# EAGLE design rekick004 (EAGLE 4.16)

## Sheet 1 of 2
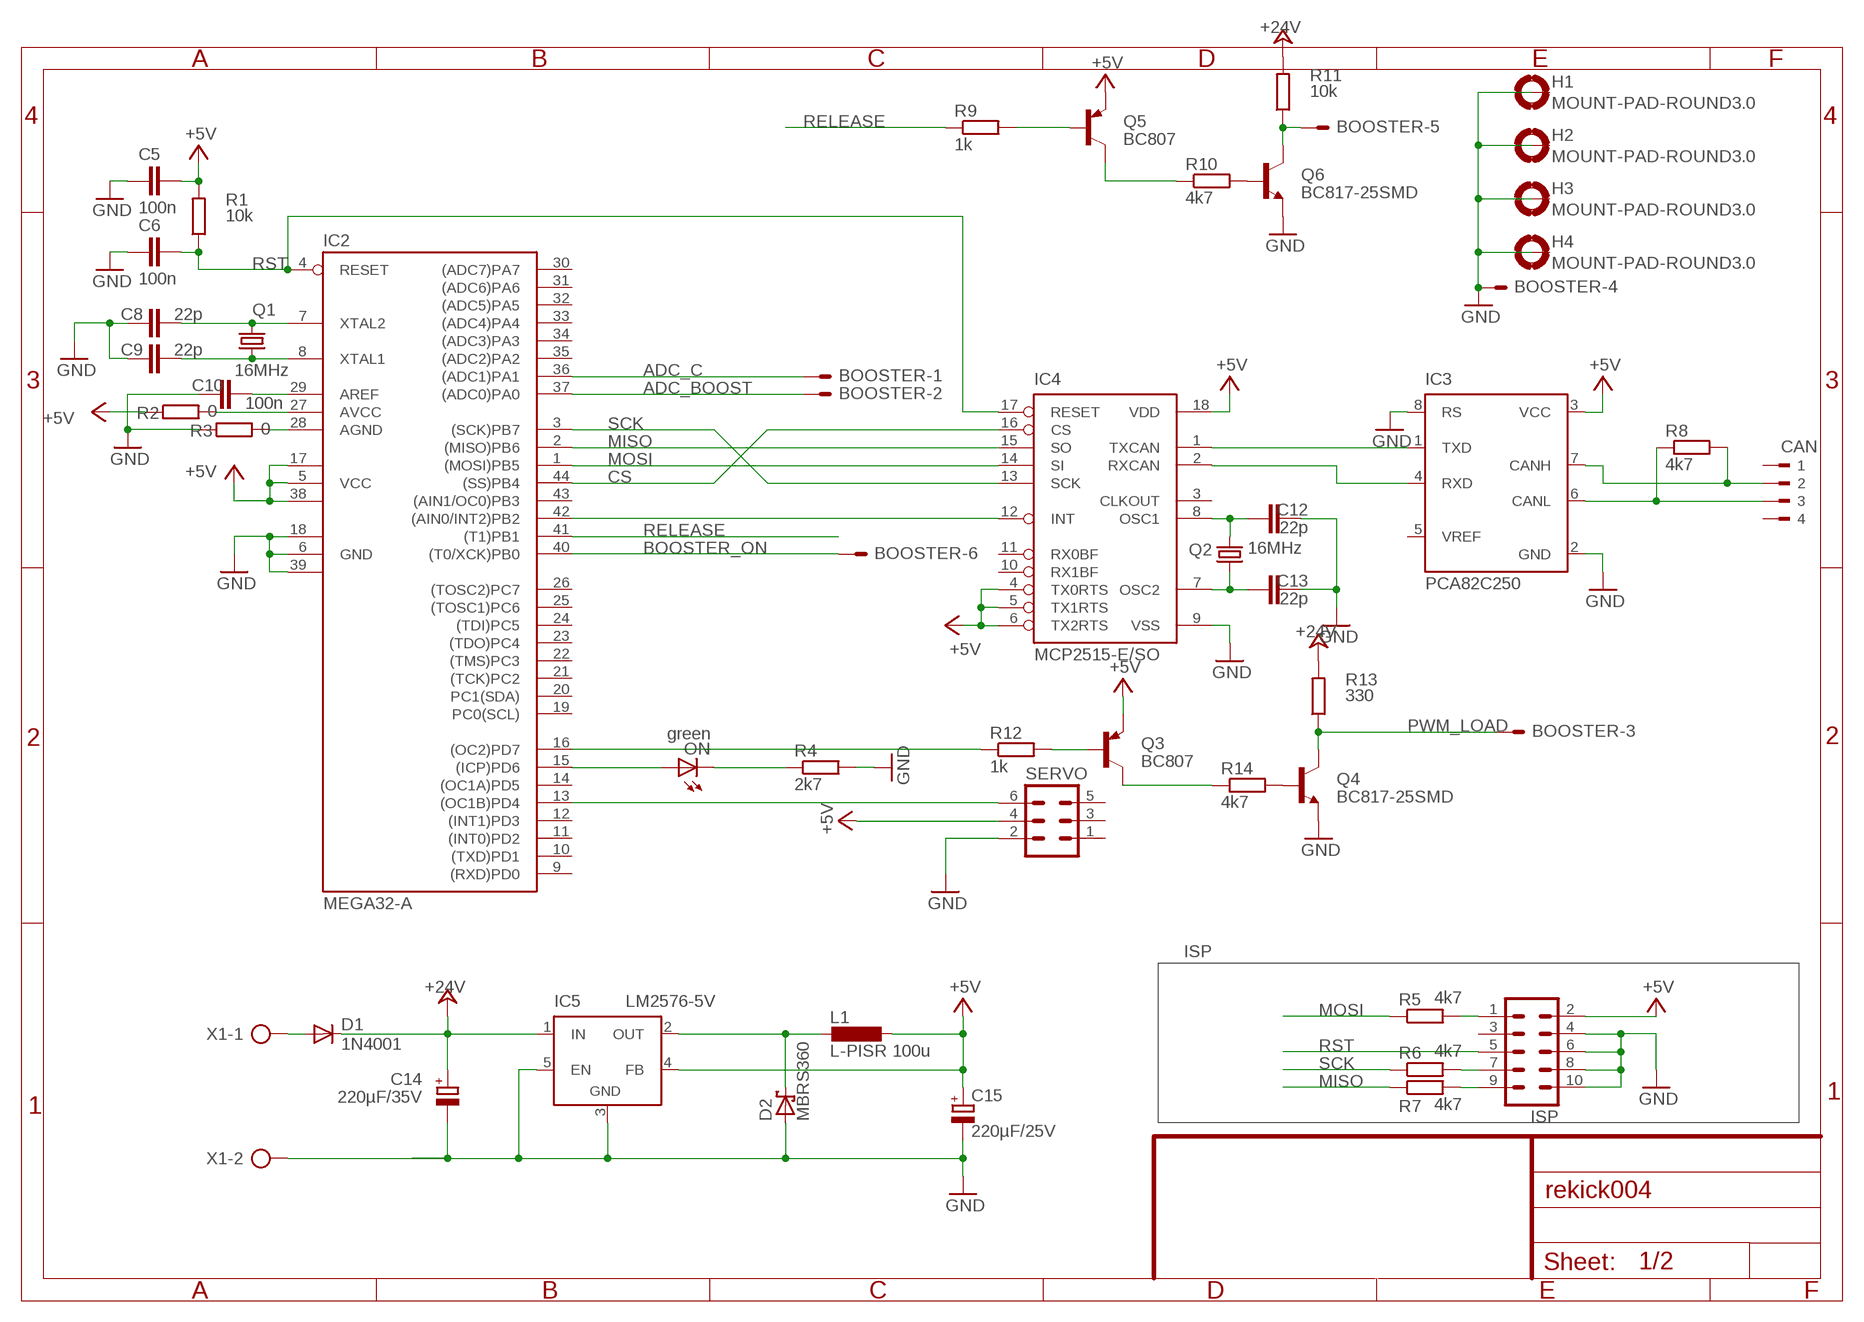
[diagram p0: schematic, sheet 1]

### Parts
BOOSTER  ML6LE  [ML6L]
C5  100n  C-EUC0603  [C0603]
C6  100n  C-EUC0603  [C0603]
C8  22p  C-EUC0603  [C0603]
C9  22p  C-EUC0603  [C0603]
C10  100n  C-EUC0603  [C0603]
C12  22p  C-EUC0603  [C0603]
C13  22p  C-EUC0603  [C0603]
C14  220µF/35V  CPOL-EUE5-10.5  [E5-10,5]
C15  220µF/25V  CPOL-EUE3.5-10  [E3,5-10]
CAN  90-4  [90-4]
D1  1N4001  1N4004  [DO41-10]
D2  MBRS360  SCHOTTKY-DIODESMD  [SMB]
H1  MOUNT-PAD-ROUND3.0  [3,0-PAD]
H2  MOUNT-PAD-ROUND3.0  [3,0-PAD]
H3  MOUNT-PAD-ROUND3.0  [3,0-PAD]
H4  MOUNT-PAD-ROUND3.0  [3,0-PAD]
IC2  MEGA32-A  [TQFP44]
IC3  PCA82C250  [DIL08]
IC4  MCP2515-E/SO  [SO18L]
IC5  LM2576-5V  LM2596TV  [TO220-51]
ISP  MA05-2  [MA05-2]
L1  L-PISR 100u  L-EUWE-TPC  [POWER-CHOKE_WE-TPC]
ON  green  LED3MM  [LED3MM]
Q1  16MHz  CRYSTALHC49S  [HC49/S]
Q2  16MHz  CRYSTALHC49U-V  [HC49U-V]
Q3  BC807  BC807-40SMD  [SOT23-BEC]
Q4  BC817-25SMD  [SOT23-BEC]
Q5  BC807  BC807-40SMD  [SOT23-BEC]
Q6  BC817-25SMD  [SOT23-BEC]
R1  10k  R-EU_R0805  [R0805]
R2  0  R-EU_R0805  [R0805]
R3  0  R-EU_R0805  [R0805]
R4  2k7  R-EU_R0805  [R0805]
R5  4k7  R-EU_R0805  [R0805]
R6  4k7  R-EU_R0805  [R0805]
R7  4k7  R-EU_R0805  [R0805]
R8  4k7  R-EU_R0805  [R0805]
R9  1k  R-EU_R0805  [R0805]
R10  4k7  R-EU_R0805  [R0805]
R11  10k  R-EU_R0805  [R0805]
R12  1k  R-EU_R0805  [R0805]
R13  330  R-EU_R0805  [R0805]
R14  4k7  R-EU_R0805  [R0805]
SERVO  ML6L  [ML6L]
X1  AK500/2-H  [AK500/2-H]

### Nets
+5V [Power]: C5.2 C15.+ IC2.5(VCC) IC2.17(VCC1) IC2.38(VCC2) IC3.3(VCC) IC4.4(TX0RTS) IC4.5(TX1RTS) IC4.6(TX2RTS) IC4.18(VDD) IC5.4(FB) ISP.2 L1.1 Q3.E Q5.E R1.2 R2.1 SERVO.4
+24V [Power]: C14.+ D1.C IC5.1(IN) R11.2 R13.2
ADC_BOOST: BOOSTER.2 IC2.37((ADC0)PA0)
ADC_C: BOOSTER.1 IC2.36((ADC1)PA1)
BOOSTER_ON: BOOSTER.6 IC2.40((T0/XCK)PB0)
CS: IC2.44((SS)PB4) IC4.16(CS)
GND [Power]: BOOSTER.4 C5.1 C6.1 C8.1 C9.2 C10.1 C12.2 C13.2 C14.- C15.- D2.A H1.B3,0(MOUNT) H2.B3,0(MOUNT) H3.B3,0(MOUNT) H4.B3,0(MOUNT) IC2.6(GND) IC2.18(GND1) IC2.39(GND2) IC3.2(GND) IC3.8(RS) IC4.9(VSS) IC5.3(GND) IC5.5(EN) ISP.4 ISP.6 ISP.8 ISP.10 Q4.E Q6.E R3.1 R4.2 SERVO.2 X1.2
MISO: IC2.2((MISO)PB6) IC4.15(SO) R7.1
MOSI: IC2.1((MOSI)PB5) IC4.14(SI) R5.1
N$1: IC2.15((ICP)PD6) ON.A
N$2: C10.2 IC2.29(AREF)
N$3: IC2.27(AVCC) R2.2
N$4: C9.1 IC2.8(XTAL1) Q1.1
N$5: C8.2 IC2.7(XTAL2) Q1.2
N$6: ISP.1 R5.2
N$7: IC2.28(AGND) R3.2
N$8: ISP.7 R6.2
N$9: ISP.9 R7.2
N$11: IC2.42((AIN0/INT2)PB2) IC4.12(INT)
N$12: IC3.1(TXD) IC4.1(TXCAN)
N$13: IC2.16((OC2)PD7) R12.1
N$14: IC2.13((OC1B)PD4) SERVO.6
N$21: Q3.C R14.1
N$22: IC3.4(RXD) IC4.2(RXCAN)
N$23: Q4.B R14.2
N$24: CAN.3 IC3.6(CANL) R8.1
N$25: Q3.B R12.2
N$26: D1.A X1.1
N$28: Q6.B R10.2
N$29: BOOSTER.5 Q6.C R11.1
N$30 [Power]: D2.C IC5.2(OUT) L1.2
N$31: ON.K(C) R4.1
N$32: Q5.C R10.1
N$33: Q5.B R9.2
N$53: C13.1 IC4.7(OSC2) Q2.1
N$54: C12.1 IC4.8(OSC1) Q2.2
N$59: CAN.2 IC3.7(CANH) R8.2
PWM_LOAD: BOOSTER.3 Q4.C R13.1
RELEASE: IC2.41((T1)PB1) R9.1
RST: C6.2 IC2.4(RESET) IC4.17(RESET) ISP.5 R1.1
SCK: IC2.3((SCK)PB7) IC4.13(SCK) R6.1
Unconnected: CAN.1 CAN.4 IC2.9((RXD)PD0) IC2.10((TXD)PD1) IC2.11((INT0)PD2) IC2.12((INT1)PD3) IC2.14((OC1A)PD5) IC2.19(PC0(SCL)) IC2.20(PC1(SDA)) IC2.21((TCK)PC2) IC2.22((TMS)PC3) IC2.23((TDO)PC4) IC2.24((TDI)PC5) IC2.25((TOSC1)PC6) IC2.26((TOSC2)PC7) IC2.30((ADC7)PA7) IC2.31((ADC6)PA6) IC2.32((ADC5)PA5) IC2.33((ADC4)PA4) IC2.34((ADC3)PA3) IC2.35((ADC2)PA2) IC2.43((AIN1/OC0)PB3) IC3.5(VREF) IC4.3(CLKOUT) IC4.10(RX1BF) IC4.11(RX0BF) ISP.3 SERVO.1 SERVO.3 SERVO.5

### Notes on the sheet
- ISP

## Sheet 2 of 2
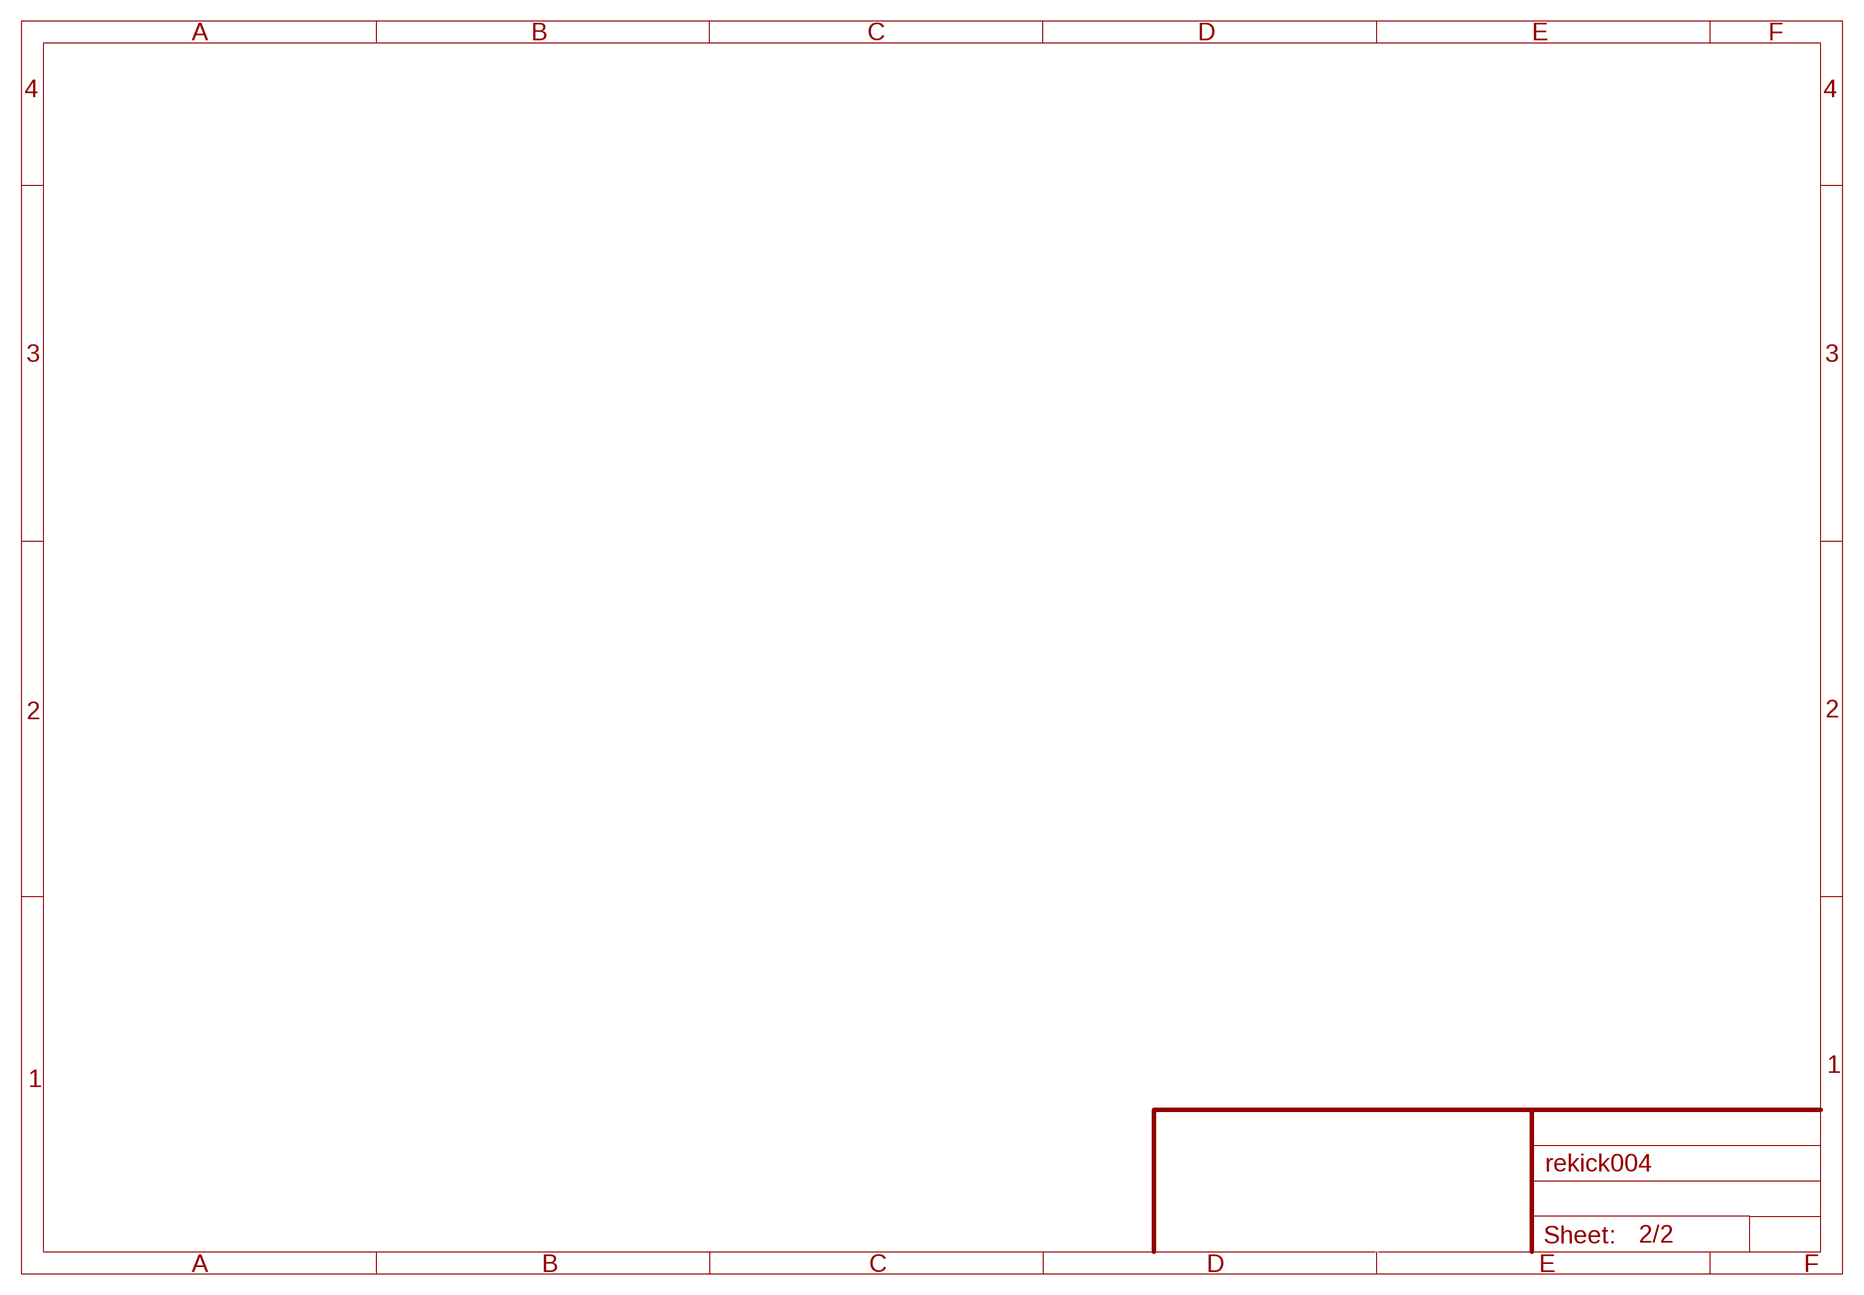
[diagram p1: schematic, sheet 2]

## Library data of the parts
BOOSTER = con-harting-ml:ML6?E: HARTING
C5 C6 C8-C10 C12 C13 = rcl:C-EU: CAPACITOR, European symbol
C14 C15 = rcl:CPOL-EU: POLARIZED CAPACITOR, European symbol
CAN = con-weidmueller-sl35:90-4: WEIDMUELLER CLAMP CONNECTOR
D1 = diode:1N4004: DIODE general purpose rectifier, 1 A
D2 = diode:SCHOTTKY-DIODE: Schottky Diode
H1-H4 = holes:MOUNT-PAD-ROUND: MOUNTING PAD, round
IC2 = atmel:MEGA32: MICROCONTROLLER 32 Kbytes FLASH 2 Kbytes SRAM 1 Kbytes EEPROM USART 8-channel 10 bit ADC Source: www.atmel.com .. doc2503.pdf
IC3 = micro-philips:PCA82C250: CAN CONTROLLER INTERFACE
IC4 = mcp2515:MCP2515
IC5 = linear:LM2596T: STEP-DOWN VOLTAGE REGULATOR
ISP = con-lstb:MA05-2: PIN HEADER
L1 = rcl:L-EU: INDUCTOR, European symbol
ON = led:LED: LED OSRAM: - CHIPLED LG R971, LG N971, LY N971, LG Q971, LY Q971, LO R971, LY R971 LH N974, LH R974 LS Q976, LO Q976, LY Q976 LO Q996 - Hyper CHIPLED LW Q18S LB Q993, LB Q99A, LB R99A - SideLED LS A670, LO A670, LY A670, LG A670, LP A670 LB A673, LV A673, LT A673, LW A673 LH A674 LY A675 LS A676, LA A676, LO A676, LY A676, LW A676 LS A679, LY A679, LG A679 - Hyper Micro SIDELED® LS Y876, LA Y876, LO Y876, LY Y876 LT Y87S - SmartLED LW L88C, LW L88S LB L89C, LB L89S, LG L890 LS L89K, LO L89K, LY L89K LS L896, LA L896, LO L896, LY L896 - TOPLED LS T670, LO T670, LY T670, LG T670, LP T670 LSG T670, LSP T670, LSY T670, LOP T670, LYG T670 LG T671, LOG T671, LSG T671 LB T673, LV T673, LT T673, LW T673 LH T674 LS T676, LA T676, LO T676, LY T676, LB T676, LH T676, LSB T676, LW T676 LB T67C, LV T67C, LT T67C, LS T67K, LO T67K, LY T67K, LW E67C LS E67B, LA E67B, LO E67B, LY E67B, LB E67C, LV E67C, LT E67C LW T67C LS T679, LY T679, LG T679 LS T770, LO T770, LY T770, LG T770, LP T770 LB T773, LV T773, LT T773, LW T773 LH T774 LS E675, LA E675, LY E675, LS T675 LS T776, LA T776, LO T776, LY T776, LB T776 LHGB T686 LT T68C, LB T68C - Hyper Mini TOPLED® LB M676 - Mini TOPLED Santana® LG M470 LS M47K, LO M47K, LY M47K Source: http://www.osram.convergy.de - LUMILED® LXK2-PW12-R00, LXK2-PW12-S00, LXK2-PW14-U00, LXK2-PW14-V00 LXK2-PM12-R00, LXK2-PM12-S00, LXK2-PM14-U00 LXK2-PE12-Q00, LXK2-PE12-R00, LXK2-PE12-S00, LXK2-PE14-T00, LXK2-PE14-U00 LXK2-PB12-K00, LXK2-PB12-L00, LXK2-PB12-M00, LXK2-PB14-N00, LXK2-PB14-P00, LXK2-PB14-Q00 LXK2-PR12-L00, LXK2-PR12-M00, LXK2-PR14-Q00, LXK2-PR14-R00 LXK2-PD12-Q00, LXK2-PD12-R00, LXK2-PD12-S00 LXK2-PH12-R00, LXK2-PH12-S00 LXK2-PL12-P00, LXK2-PL12-Q00, LXK2-PL12-R00 Source: www.luxeon.com
Q1 Q2 = crystal:CRYSTAL: CRYSTAL
Q3 Q5 = transistor-pnp:BC807*: PNP Transistror
Q4 Q6 = transistor-npn:BC817*: NPN Transistor
R1-R14 = rcl:R-EU_: RESISTOR, European symbol
SERVO = con-harting-ml:ML6: HARTING
X1 = con-ptr500:AK500/2-H: CONNECTOR Aug. 2004 / PTR Meßtechnik: Die Bezeichnung der Serie AK505 wurde geändert. Es handelt sich hierbei um AK500 in horizontaler Ausführung.

## Net classes
1 Power: width 0.406 mm
2 High Power: width 2 mm

## Board
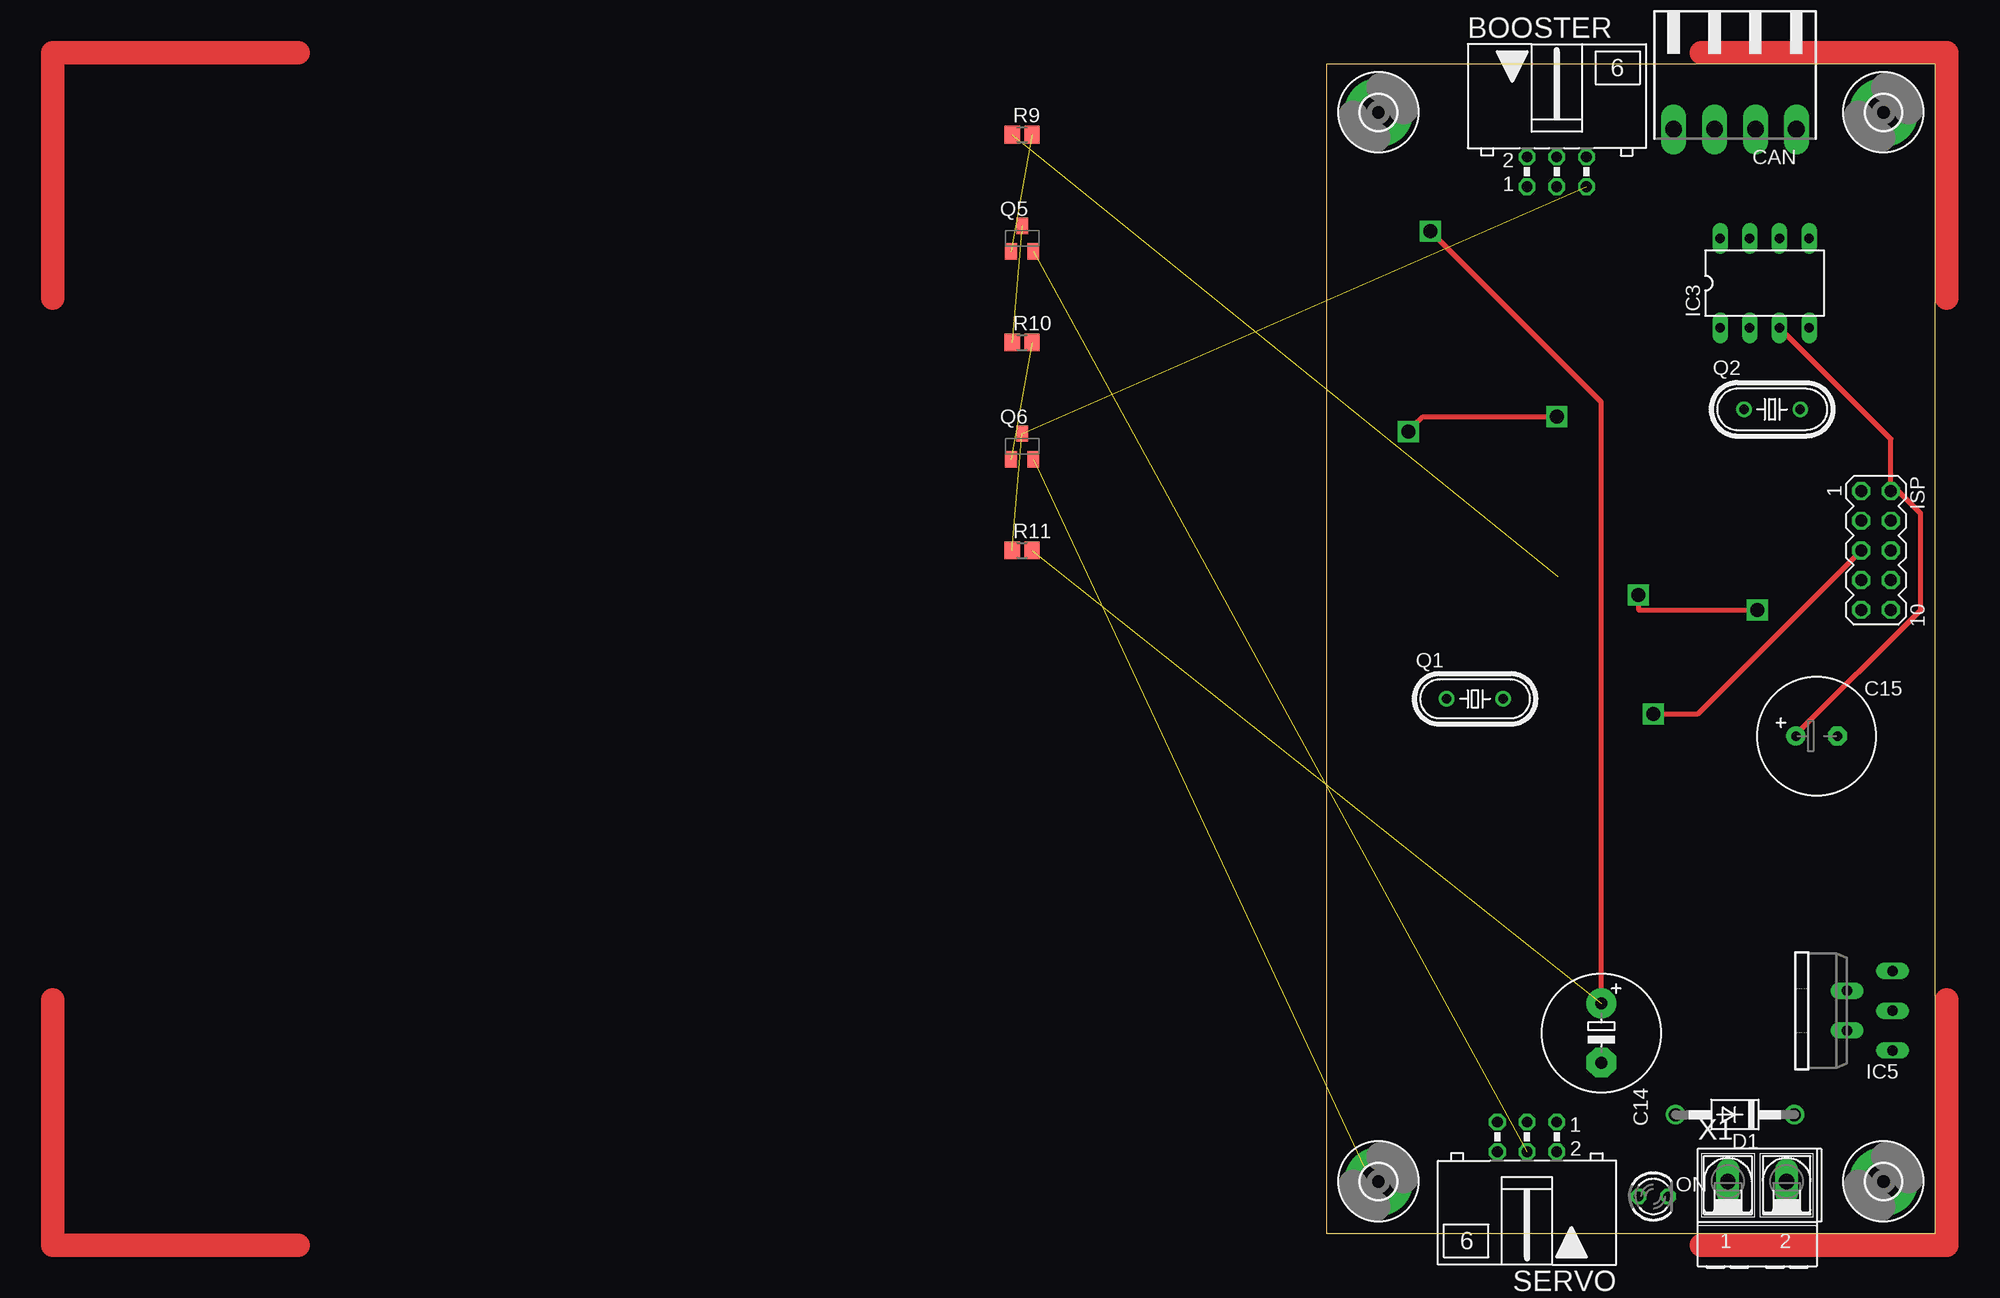
[diagram p2: board, top side]
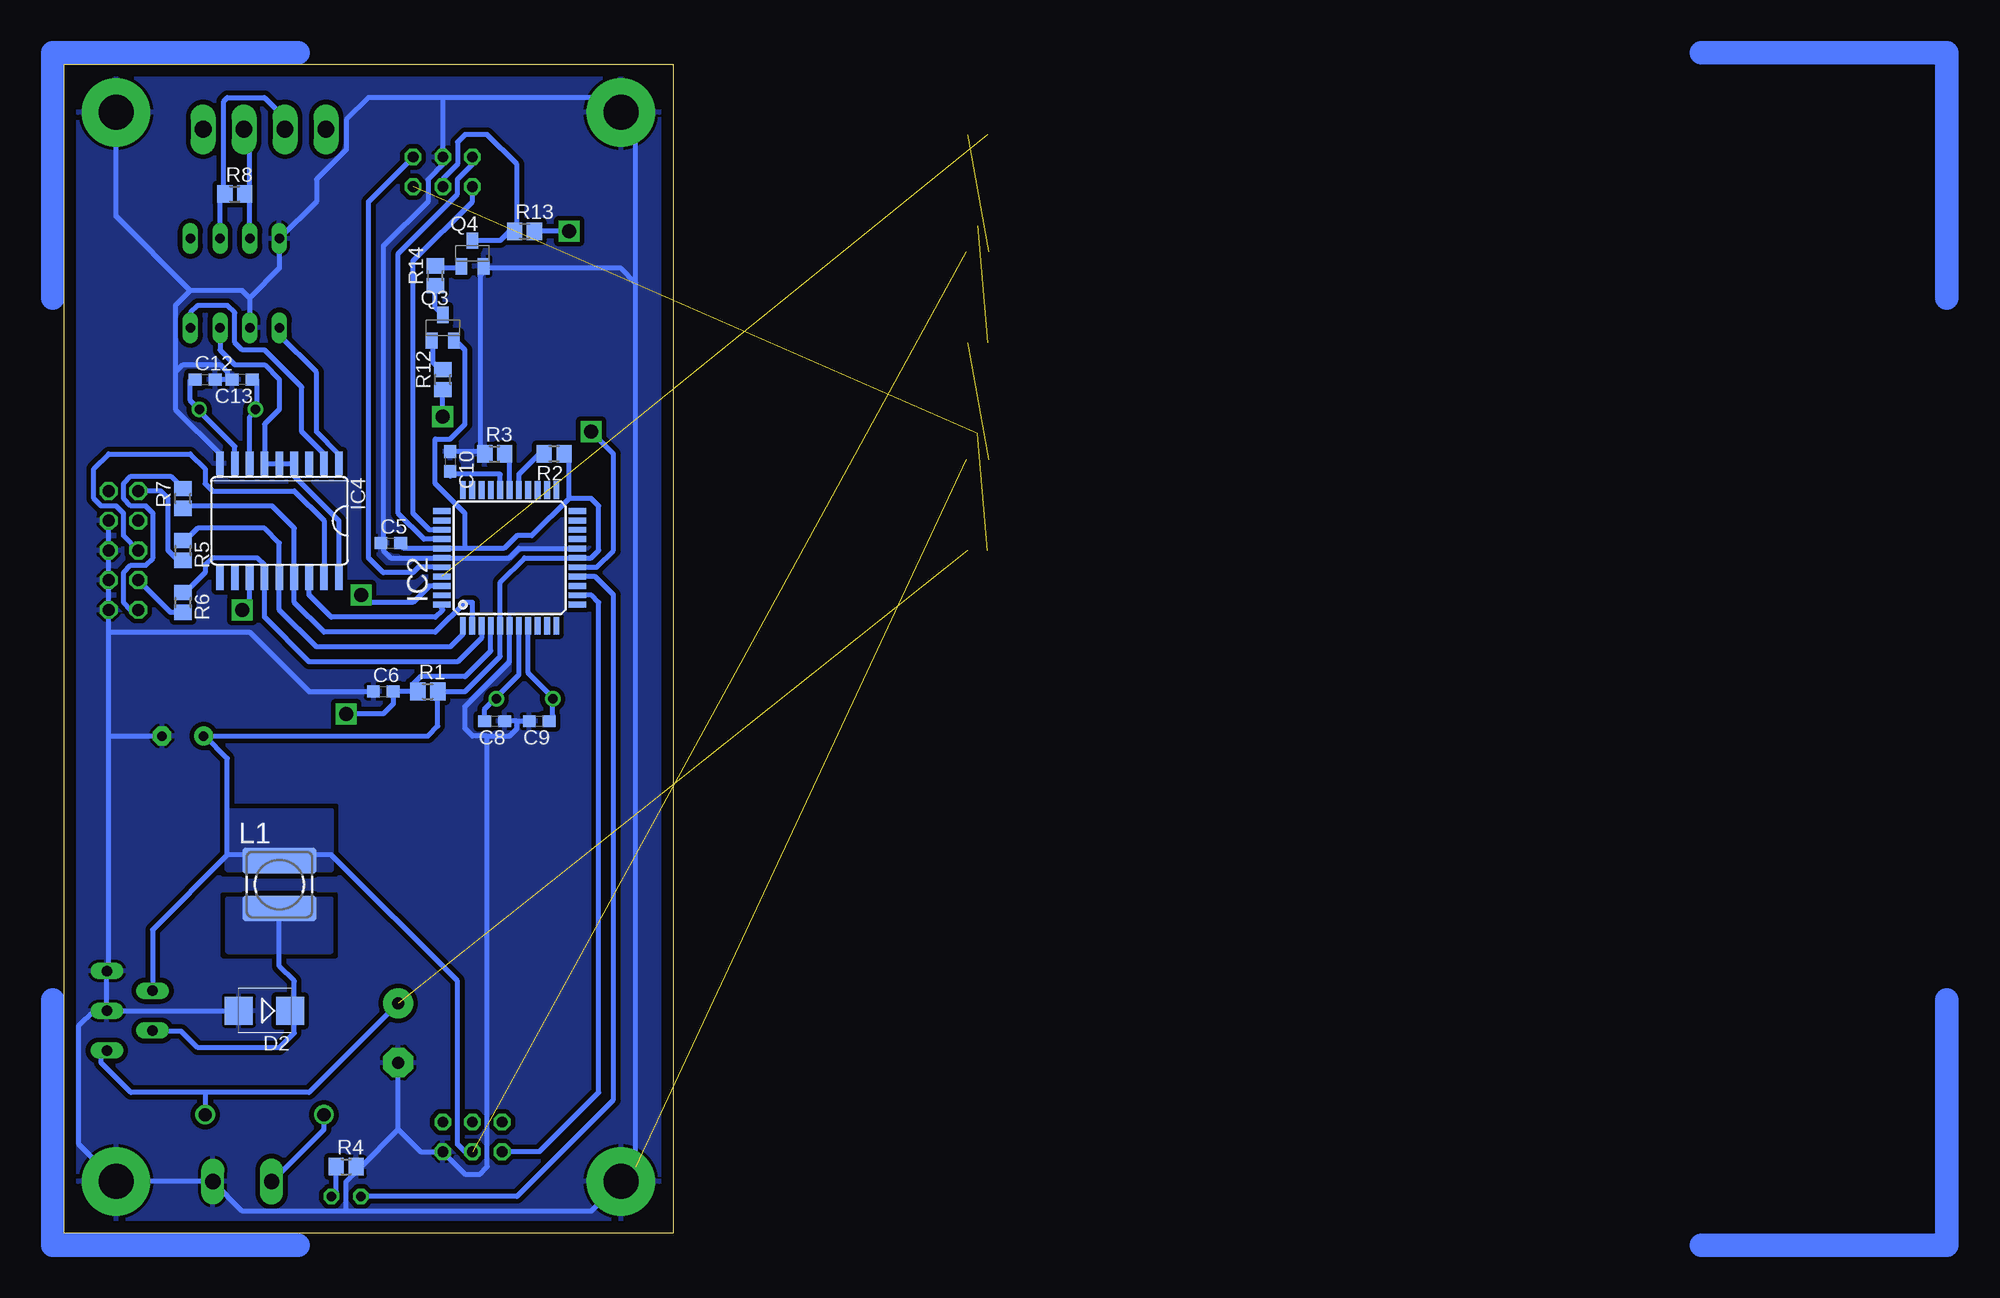
[diagram p3: board, bottom side, seen from below]

Size 52.05 x 100 mm. Coordinates in mm from the lower left corner, seen from the top.
Outline: 0,0 52.05,0 52.05,100 0,100 0,0
Copper layers (1*16): Top 0.035mm / dielectric 1.5mm / Bottom 0.035mm
Design rules "olimex_10mils": minimum track width 10mil, minimum drill 24mil, track to track 10mil, track to pad 10mil, pad to pad 10mil, via to via 10mil, smd to smd 10mil, copper to edge 40mil, drill to drill 10mil, minimum pad ring 10mil, minimum via ring 8mil, stop-mask expansion 0mil, vias tented up to drill 0mil, thermal gap 10mil

### Footprints (pad centres in the part's own frame; a part is rotated, then mirrored left to right if it is on the bottom)
ML6L = drill 0.914 octagon: 1 -2.54,-1.27; 2 -2.54,1.27; 3 0,-1.27; 4 0,1.27; 5 2.54,-1.27; 6 2.54,1.27
C0603 = smd 1.1 x 1: 1 -0.85,0; 2 0.85,0
E5-10,5 = drill 1.016 pad 2.54 round: + -2.54,0 | drill 1.016 pad 2.54 octagon: - 2.54,0
E3,5-10 = drill 0.813 pad 1.6 round: + -1.778,0 | drill 0.813 pad 1.6 octagon: - 1.778,0
90-4 = drill 1.422 long: 1 -5.25,5.25; 2 -1.75,5.25; 3 1.75,5.25; 4 5.25,5.25
DO41-10 = drill 1.118 round: A 5.08,0; C -5.08,0
SMB = smd 2.4 x 2.4: A 2.2,0; C -2.2,0
3,0-PAD = drill 3 pad 5.842 round: B3,0 0,0
TQFP44 = smd 1.5 x 0.5: 1 -5.8,4; 2 -5.8,3.2; 3 -5.8,2.4; 4 -5.8,1.6; 5 -5.8,0.8; 6 -5.8,0; 7 -5.8,-0.8; 8 -5.8,-1.6; 9 -5.8,-2.4; 10 -5.8,-3.2; 11 -5.8,-4; 23 5.8,-4; 24 5.8,-3.2; 25 5.8,-2.4; 26 5.8,-1.6; 27 5.8,-0.8; 28 5.8,0; 29 5.8,0.8; 30 5.8,1.6; 31 5.8,2.4; 32 5.8,3.2; 33 5.8,4 | smd 0.5 x 1.5: 12 -4,-5.8; 13 -3.2,-5.8; 14 -2.4,-5.8; 15 -1.6,-5.8; 16 -0.8,-5.8; 17 0,-5.8; 18 0.8,-5.8; 19 1.6,-5.8; 20 2.4,-5.8; 21 3.2,-5.8; 22 4,-5.8; 34 4,5.8; 35 3.2,5.8; 36 2.4,5.8; 37 1.6,5.8; 38 0.8,5.8; 39 0,5.8; 40 -0.8,5.8; 41 -1.6,5.8; 42 -2.4,5.8; 43 -3.2,5.8; 44 -4,5.8
DIL08 = drill 0.813 long: 1 -3.81,-3.81; 2 -1.27,-3.81; 3 1.27,-3.81; 4 3.81,-3.81; 5 3.81,3.81; 6 1.27,3.81; 7 -1.27,3.81; 8 -3.81,3.81
SO18L = smd 0.66 x 2.032: 1 -5.08,-4.902; 2 -3.81,-4.902; 3 -2.54,-4.902; 4 -1.27,-4.902; 5 0,-4.902; 6 1.27,-4.902; 7 2.54,-4.902; 8 3.81,-4.902; 9 5.08,-4.902; 10 5.08,4.902; 11 3.81,4.902; 12 2.54,4.902; 13 1.27,4.902; 14 0,4.902; 15 -1.27,4.902; 16 -2.54,4.902; 17 -3.81,4.902; 18 -5.08,4.902
TO220-51 = drill 0.9 long: 1 -3.4,-8.4; 2 -1.7,-4.5; 3 0,-8.4; 4 1.7,-4.5; 5 3.4,-8.4
MA05-2 = drill 1.016 octagon: 1 -5.08,-1.27; 2 -5.08,1.27; 3 -2.54,-1.27; 4 -2.54,1.27; 5 0,-1.27; 6 0,1.27; 7 2.54,-1.27; 8 2.54,1.27; 9 5.08,-1.27; 10 5.08,1.27
POWER-CHOKE_WE-TPC = smd 6.3 x 2.2: 1 0,2.05; 2 0,-2.05
LED3MM = drill 0.813 octagon: A -1.27,0; K 1.27,0
HC49/S = drill 0.813 round: 1 -2.413,0; 2 2.413,0
HC49U-V = drill 0.813 round: 1 -2.413,0; 2 2.413,0
SOT23-BEC = smd 1 x 1.4: B -0.95,-1.1; C 0,1.1; E 0.95,-1.1
R0805 = smd 1.3 x 1.5: 1 -0.85,0; 2 0.85,0
AK500/2-H = drill 1.321 long: 1 -2.515,0; 2 2.515,0

### Placement (x,y rotation side)
BOOSTER  19.69,90.81 0 top
C5  24.13,59.05 0 bottom
C6  24.77,46.35 0 bottom
C8  15.24,43.81 180 bottom
C9  11.43,43.81 180 bottom
C10  19.05,66.04 270 bottom
C12  40.01,73.03 0 bottom
C13  36.83,73.03 180 bottom
C14  23.49,17.14 270 top
C15  41.91,42.55 0 top
CAN  34.92,99.69 180 top
D1  34.92,10.16 180 top
D2  34.92,19.05 180 bottom
H1  4.44,95.89 0 top
H2  4.44,4.45 0 top
H3  47.62,95.89 0 top
H4  47.62,4.45 0 top
IC2  13.97,57.78 90 bottom
IC3  37.46,81.28 0 top
IC4  33.65,60.96 180 bottom
IC5  40.01,19.05 90 top
ISP  46.99,58.42 270 top
L1  33.65,29.84 0 bottom
ON  27.94,3.17 0 top
Q1  12.7,45.72 0 top
Q2  38.1,70.48 0 top
Q3  19.69,77.47 0 bottom
Q4  17.14,83.82 0 bottom
Q5  -26.03,85.09 0 top  (outside the outline)
Q6  -26.03,67.31 0 top  (outside the outline)
R1  20.95,46.35 0 bottom
R2  10.16,66.67 180 bottom
R3  15.24,66.67 0 bottom
R4  27.94,5.71 0 bottom
R5  41.91,58.42 270 bottom
R6  41.91,53.98 270 bottom
R7  41.91,62.87 90 bottom
R8  37.46,88.9 0 bottom
R9  -26.03,93.98 0 top  (outside the outline)
R10  -26.03,76.2 0 top  (outside the outline)
R11  -26.03,58.42 0 top  (outside the outline)
R12  19.69,73.03 90 bottom
R13  12.7,85.72 0 bottom
R14  20.32,81.92 90 bottom
SERVO  17.14,8.26 180 top
X1  36.83,4.45 0 top

### Tracks (layer width: path | path; a pad name or v marks a point on that pad's centre or on a via)
+5V  (1 unrouted)
  Top 0.406: IC3.3 48.26,67.94 ISP.2 48.89,63.5 50.8,61.59 50.8,53.34 40.01,42.55 C15.+
  Bottom 0.406: 8.25,57.78 12.7,57.78 14.77,55.72 IC2.5 14.77,49.37 17.78,46.35 R1.2 20.11,43.4 20.95,42.55 40.01,42.55 | 17.78,58.59 14.44,58.59 13.33,59.69 12.06,59.69 8.89,62.87 | 17.78,58.59 IC2.38 23.02,58.59 23.49,59.05 C5.2 | 8.25,57.78 IC2.17 | R2.1 8.89,66.25 8.89,62.87 | IC3.3 38.73,75.56 37.46,74.3 34.92,74.3 33.65,73.03 33.65,70.48 34.92,69.22 IC4.6 33.83,65.86 33.65,66.04 IC4.5 32.56,65.86 32.39,66.04 IC4.4 32.39,64.77 28.58,60.96 IC4.18 | 17.78,58.59 17.78,61.59 20.32,64.14 20.32,67.94 19.05,67.94 17.78,69.22 17.78,75.56 18.41,76.2 | 18.41,76.2 18.56,76.2 | 18.41,76.2 18.58,76.37 Q3.E | SERVO.4 17.78,6.99 18.41,7.62 18.41,21.59 29.21,32.38 33.65,32.38 | 8.25,57.78 6.98,57.78 6.35,58.42 6.35,62.23 6.98,62.87 8.89,62.87 | 33.65,32.38 L1.1 | IC5.4 44.51,25.98 38.1,32.38 | 33.65,32.38 38.1,32.38 | 38.1,32.38 38.1,40.64 40.01,42.55 | 40.01,42.55 C15.+
  pour Bottom (isolate 1.016, no thermals): 29.21,31.11 38.1,31.11 38.1,36.2 29.21,36.2
+24V  (via drill 1.2)  (1 unrouted)
  Top 0.406: C14.+ 23.49,71.12 v8.89,85.72
  Bottom 0.406: IC5.1 49.04,15.73 48.89,15.88 48.89,14.61 46.36,12.06 40.01,12.06 | 40.01,12.06 31.11,12.06 C14.+ | 12.06,85.72 R13.2 v8.89,85.72 | 40.01,12.06 D1.C
ADC_BOOST
  Bottom 0.406: IC2.37 21.29,59.38 23.49,61.59 23.49,83.82 18.41,88.9 18.41,90.17 17.14,91.44 BOOSTER.2
ADC_C
  Bottom 0.406: IC2.36 20.81,60.19 22.23,61.59 22.23,83.19 17.14,88.27 BOOSTER.1
BOOSTER_ON
  Bottom 0.406: IC2.40 21.76,56.98 22.23,56.52 24.77,56.52 26.04,57.78 26.04,88.27 BOOSTER.6
CS
  Bottom 0.406: IC4.16 31.11,54.61 29.21,52.7 20.32,52.7 19.69,53.34 19.77,53.42 IC2.44
GND  (1 unrouted)
  Bottom 0.406: IC2.18 13.17,58.59 13.97,57.78 IC2.39 24.13,57.78 24.77,58.42 24.77,59.05 C5.1 24.77,59.27 24.77,84.45 20.95,88.27 20.95,90.17 19.69,91.44 BOOSTER.4 19.69,97.16 | 12.06,43.81 C9.2 13.33,43.81 | 13.33,43.81 C8.1 | IC2.6 13.97,48.9 17.78,45.09 17.78,43.18 17.14,42.55 15.88,42.55 | 13.33,43.81 13.33,43.18 13.97,42.55 15.88,42.55 | ISP.4 ISP.6 ISP.8 ISP.10 48.26,51.44 | 38.1,73.03 C12.2 | IC4.9 38.73,66.67 42.55,70.48 42.55,73.66 | 42.55,73.66 41.91,74.3 38.73,74.3 38.1,73.66 38.1,73.03 | 38.1,73.03 C13.2 | 36.2,80.01 IC3.2 | 36.2,80.01 36.83,80.64 41.27,80.64 | 41.27,80.64 42.55,79.38 42.55,73.66 | 36.2,80.01 33.65,82.55 IC3.8 30.48,88.27 30.48,90.17 27.94,92.71 27.94,95.25 26.04,97.16 19.69,97.16 | H3.B3,0 47.62,87 41.27,80.64 | 15.88,82.55 4.44,82.55 3.17,81.28 | 15.88,82.55 16.02,82.55 Q4.E 16.05,82.72 15.88,82.55 | 27.09,5.29 R4.2 26.67,5.71 | IC5.3 49.53,19.05 50.8,17.78 50.8,7.62 H4.B3,0 39.37,4.45 | IC5.3 48.4,22.08 48.26,22.23 | C6.1 31.11,46.35 36.2,51.44 48.26,51.44 | C10.1 16.09,66.89 15.88,66.67 R3.1 16.51,66.67 16.51,81.92 15.88,82.55 | 19.69,97.16 5.72,97.16 H1.B3,0 3.17,94.61 3.17,81.28 | 3.17,81.28 3.17,5.71 H2.B3,0 6.98,1.91 27.94,1.91 | 39.37,4.45 X1.2 | 27.94,1.91 36.83,1.91 39.37,4.45 | 26.67,5.71 27.94,4.45 27.94,1.91 | 26.67,5.71 23.49,8.89 | 23.49,8.89 C14.- | 23.49,8.89 21.59,6.99 SERVO.2 17.78,5.08 16.51,5.08 15.88,5.71 15.88,42.55 | IC5.3 D2.A | 48.26,22.23 48.4,22.37 IC5.5 | 48.26,22.23 48.26,42.55 | 48.26,42.55 48.26,51.44 | 48.26,42.55 C15.-
  pour Bottom (isolate 0.406, rank 3): 0,100.33 52.07,100.33 52.07,0 0,0
MISO
  Bottom 0.406: IC2.2 17.14,52.01 17.14,53.98 17.78,53.98 20.32,51.44 29.84,51.44 32.39,53.98 IC4.15 32.39,60.33 34.29,62.23 41.27,62.23 41.91,61.59 R7.1
MOSI
  Bottom 0.406: IC2.1 17.97,51.24 19.05,50.16 30.48,50.16 33.65,53.34 IC4.14 33.65,59.05 34.92,60.33 40.64,60.33 41.91,59.05 R5.1
N$1
  Bottom 0.406: IC2.15 6.66,56.19 5.08,54.61 5.08,11.43 13.33,3.17 ON.A
N$2
  Bottom 0.406: IC2.29 14.77,64.94 18.88,64.94 19.05,64.77 C10.2
N$3
  Bottom 0.406: R2.2 11.43,66.67 13.17,64.94 IC2.27
N$4
  Bottom 0.406: C9.1 10.8,43.81 10.29,44.32 Q1.1 10.16,45.72 12.37,47.93 IC2.8
N$5
  Bottom 0.406: IC2.7 13.17,47.79 15.24,45.72 | 15.24,45.72 Q1.2 | C8.2 16.09,44.87 15.24,45.72
N$6
  Bottom 0.406: R5.2 42.33,57.57 43.18,58.42 43.18,62.87 43.81,63.5 ISP.1
N$7
  Bottom 0.406: R3.2 13.97,66.67 IC2.28
N$8
  Bottom 0.406: R6.2 42.96,53.12 ISP.7
N$9
  Bottom 0.406: ISP.9 46.36,53.34 46.99,53.98 46.99,56.52 46.36,57.15 45.08,57.15 44.45,57.78 44.45,61.59 45.08,62.23 46.36,62.23 46.99,62.87 46.99,64.14 46.36,64.77 42.96,64.77 R7.2
N$10
  Top 2: -87.95,-1 -108.95,-1 -108.95,20
N$11  (via drill 1.2)
  Top 0.406: v26.67,54.61 26.67,53.34 v36.83,53.34
  Bottom 0.406: IC2.42 20.81,55.38 22.23,53.98 26.04,53.98 v26.67,54.61 | IC4.12 36.2,53.98 v36.83,53.34
N$12
  Bottom 0.406: IC3.1 33.65,76.83 30.48,73.66 30.48,68.58 28.58,66.67 IC4.1
N$13  (via drill 1.2)
  Top 0.406: v19.69,69.85 8.25,69.85 v6.98,68.58
  Bottom 0.406: IC2.16 6.52,56.98 5.08,58.42 5.08,66.67 v6.98,68.58 | v19.69,69.85 R12.1
N$14
  Bottom 0.406: IC2.13 6.96,54.59 6.35,53.98 6.35,12.06 11.43,6.99 SERVO.6
N$15
  Top 2: 32.05,-1 53.05,-1 53.05,20
N$16
  Top 2: -87.95,101 -108.95,101 -108.95,80
N$17
  Top 2: 53.05,80 53.05,101 32.05,101
N$18
  Bottom 2: -87.95,-1 -108.95,-1 -108.95,20
N$19
  Bottom 2: 32.05,-1 53.05,-1 53.05,20
N$20
  Bottom 2: -87.95,101 -108.95,101 -108.95,80
N$21
  Bottom 0.406: Q3.C 20.32,79.2 R14.1
N$22
  Bottom 0.406: IC3.4 41.27,78.74 40.64,79.38 38.1,79.38 37.46,78.74 37.46,76.2 36.83,75.56 34.92,75.56 31.75,72.39 31.75,68.58 29.84,66.67 IC4.2
N$23
  Bottom 0.406: R14.2 20.32,82.55 18.27,82.55 Q4.B
N$24
  Bottom 0.406: IC3.6 38.73,88.9 38.42,88.9 | CAN.3 33.17,94.46 33.02,94.61 33.65,95.25 33.65,95.89 34.92,97.16 38.1,97.16 38.42,96.84 38.42,88.9 | 38.42,88.9 R8.1
N$25
  Bottom 0.406: Q3.B 20.49,76.37 20.49,74.47 19.69,73.66 R12.2
N$26
  Bottom 0.406: X1.1 34.29,4.45 29.84,8.89 D1.A
N$27
  Bottom 2: 53.05,80 53.05,101 32.05,101
N$28  (1 unrouted)
N$29  (2 unrouted)
N$30
  Bottom 0.406: 44.45,17.3 44.45,17.14 | 44.45,17.3 IC5.2 | 33.02,19.05 D2.C 32.39,19.05 | 44.45,17.3 42.06,17.3 40.64,15.88 33.65,15.88 32.39,17.14 32.39,19.05 | L1.2 33.65,22.86 32.39,21.59 32.39,19.05
  pour Bottom (isolate 1.016, no thermals): 29.21,28.57 38.1,28.57 38.1,24.13 29.21,24.13
N$31
  Bottom 0.406: R4.1 28.79,3.6 ON.K
N$32  (1 unrouted)
N$33  (1 unrouted)
N$53
  Bottom 0.406: IC4.7 36.2,69.85 35.56,70.48 Q2.1 35.56,70.61 35.56,73.03 C13.1
N$54
  Bottom 0.406: IC4.8 37.46,67.31 40.64,70.48 Q2.2 41.27,71.25 41.27,73.03 C12.1
N$59
  Bottom 0.406: IC3.7 36.2,88.9 | 36.2,88.9 R8.2 | 36.67,94.46 36.83,94.61 | 36.67,94.46 CAN.2 | 36.2,88.9 36.2,93.98 36.67,94.46
PWM_LOAD
  Bottom 0.406: BOOSTER.3 19.69,90.17 18.41,91.44 18.41,93.34 17.78,93.98 15.88,93.98 13.33,91.44 13.33,85.94 R13.1 13.97,85.72 14.77,84.92 Q4.C
RELEASE  (1 unrouted)
RST  (via drill 1.2)
  Top 0.406: v27.94,44.45 31.75,44.45 ISP.5
  Bottom 0.406: IC2.4 15.57,49.84 17.78,47.62 21.59,47.62 22.23,46.99 22.23,46.35 | 22.23,46.35 R1.1 | 29.84,55.88 IC4.17 29.84,60.96 32.39,63.5 39.37,63.5 40.01,64.14 40.01,65.41 41.27,66.67 48.26,66.67 49.53,65.41 49.53,62.87 48.89,62.23 47.62,62.23 46.99,61.59 46.99,59.69 ISP.5 | 22.23,46.35 C6.2 23.92,45.3 24.77,44.45 v27.94,44.45
SCK
  Bottom 0.406: IC2.3 16.37,50.94 18.41,48.9 31.11,48.9 34.92,52.7 IC4.13 34.92,57.15 35.56,57.78 39.37,57.78 40.01,57.15 40.01,56.52 41.27,55.24 41.91,55.24 R6.1